# EAGLE design PBase (EAGLE 5.11)
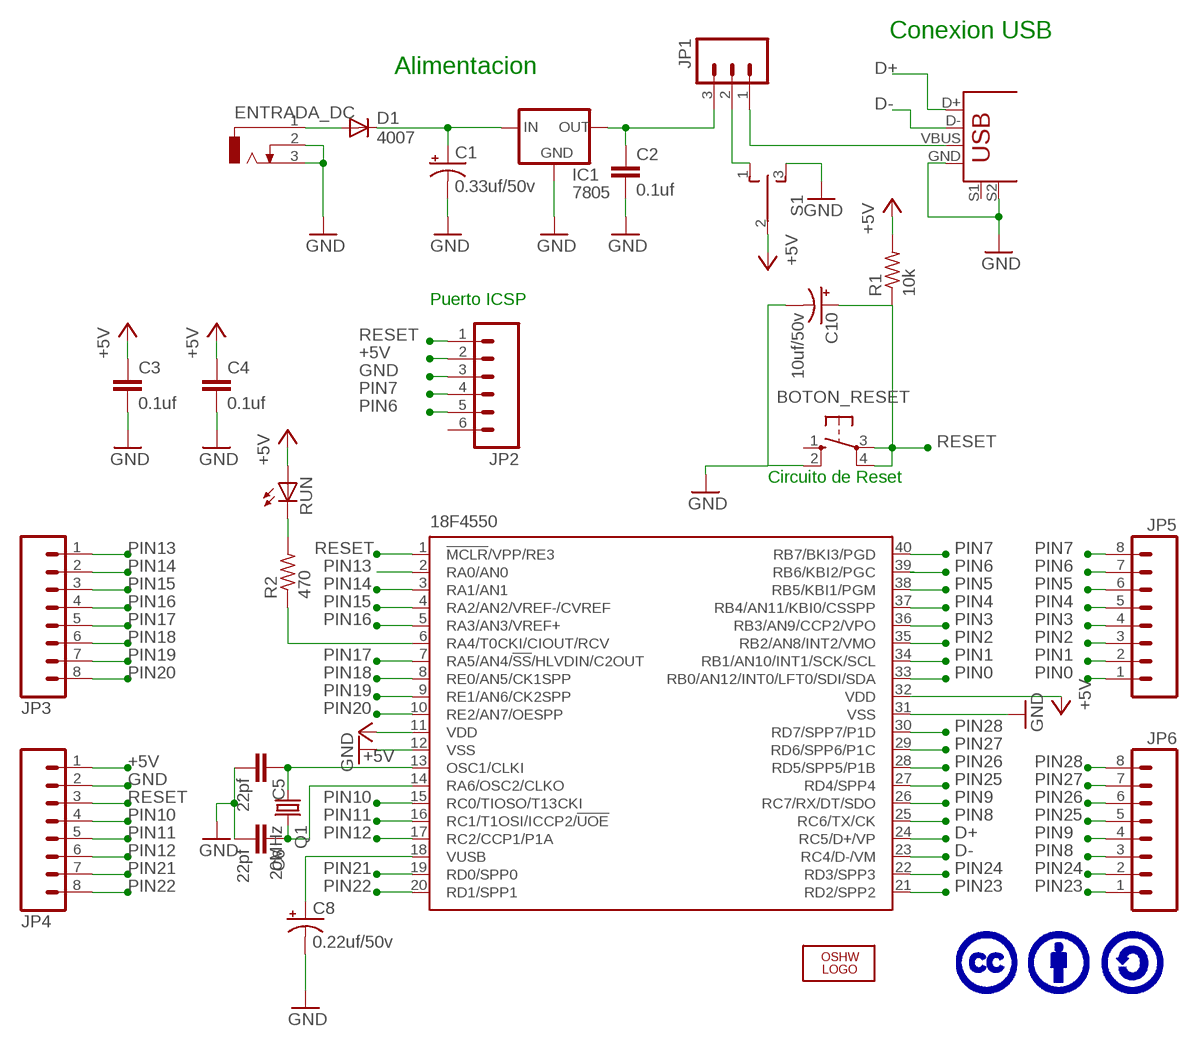
[diagram p0: schematic, sheet 1]

## Parts
18F4550  PIC18F4550_40  [DIL40]
BOTON_RESET  10-XX  [B3F-10XX]
C1  0.33uf/50v  CAP_POLPTH2  [CPOL-RADIAL-10UF-25V]
C2  0.1uf  CAPPTH2  [CAP-PTH-SMALL2]
C3  0.1uf  CAPPTH2  [CAP-PTH-SMALL2]
C4  0.1uf  CAPPTH2  [CAP-PTH-SMALL2]
C5  22pf  CAPPTH2  [CAP-PTH-SMALL2]
C6  22pf  CAPPTH2  [CAP-PTH-SMALL2]
C8  0.22uf/50v  CAP_POLPTH2  [CPOL-RADIAL-10UF-25V]
C10  10uf/50v  CAP_POLPTH2  [CPOL-RADIAL-10UF-25V]
D1  4007  1N4148DO35-7  [DO35-7]
ENTRADA_DC  DCJ0303  [DCJ0303]
IC1  7805  78XXL  [78XXL]
JP1  M03LONGPADS  [1X03_LONGPADS]
JP2  M06LONGPADS  [1X06_LONGPADS]
JP3  M08LONGPADS  [1X08_LONGPADS]
JP4  M08LONGPADS  [1X08_LONGPADS]
JP5  M08LONGPADS  [1X08_LONGPADS]
JP6  M08LONGPADS  [1X08_LONGPADS]
LOGO1  OSHW_LOGO_FILLX0200-NT  [OSHW_FILLX200_NOTEXT]
Q1  20MHz  CRYSTALHC49U-V  [HC49U-V]
R1  10k  R-US_0207/7  [0207/7]
R2  470  R-US_0207/7  [0207/7]
RUN  LED3MM  [LED3MM]
S1  TL39YOSWITCH_2_ESTADOS  [TL3XYO]
U$1  USB+SHIELD  [USB-B-PTH]

## Nets
+5V: 18F4550.11(VDD) 18F4550.32(VDD) C3.1 C4.1 JP2.2 JP4.1 R1.2 RUN.A S1.2(P)
D+: 18F4550.24(RC5/D+/VP) U$1.D+
D-: 18F4550.23(RC4/D-/VM) U$1.D-
GND: 18F4550.12(VSS) 18F4550.31(VSS) BOTON_RESET.2(S1) C1.2(-) C2.2 C3.2 C4.2 C5.2 C6.2 C8.2(-) C10.2(-) ENTRADA_DC.2 ENTRADA_DC.3 IC1.GND JP2.3 JP4.2 S1.3(S) U$1.GND U$1.S2
N$1: 18F4550.13(OSC1/CLKI) C5.1 Q1.1
N$2: C1.1(+) D1.C IC1.IN
N$3: C2.1 IC1.OUT JP1.3
N$4: JP1.1 U$1.VBUS
N$5: 18F4550.14(RA6/OSC2/CLKO) C6.1 Q1.2
N$6: 18F4550.18(VUSB) C8.1(+)
N$7: R2.2 RUN.K(C)
N$8: 18F4550.6(RA4/T0CKI/CIOUT/RCV) R2.1
N$10: JP1.2 S1.1(O)
N$11: D1.A ENTRADA_DC.1
PIN0: 18F4550.33(RB0/AN12/INT0/LFT0/SDI/SDA) JP5.1
PIN1: 18F4550.34(RB1/AN10/INT1/SCK/SCL) JP5.2
PIN2: 18F4550.35(RB2/AN8/INT2/VMO) JP5.3
PIN3: 18F4550.36(RB3/AN9/CCP2/VPO) JP5.4
PIN4: 18F4550.37(RB4/AN11/KBI0/CSSPP) JP5.5
PIN5: 18F4550.38(RB5/KBI1/PGM) JP5.6
PIN6: 18F4550.39(RB6/KBI2/PGC) JP2.5 JP5.7
PIN7: 18F4550.40(RB7/BKI3/PGD) JP2.4 JP5.8
PIN8: 18F4550.25(RC6/TX/CK) JP6.3
PIN9: 18F4550.26(RC7/RX/DT/SDO) JP6.4
PIN10: 18F4550.15(RC0/TIOSO/T13CKI) JP4.4
PIN11: 18F4550.16(RC1/T1OSI/ICCP2/!UOE) JP4.5
PIN12: 18F4550.17(RC2/CCP1/P1A) JP4.6
PIN13: 18F4550.2(RA0/AN0) JP3.1
PIN14: 18F4550.3(RA1/AN1) JP3.2
PIN15: 18F4550.4(RA2/AN2/VREF-/CVREF) JP3.3
PIN16: 18F4550.5(RA3/AN3/VREF+) JP3.4
PIN17: 18F4550.7(RA5/AN4/!SS!/HLVDIN/C2OUT) JP3.5
PIN18: 18F4550.8(RE0/AN5/CK1SPP) JP3.6
PIN19: 18F4550.9(RE1/AN6/CK2SPP) JP3.7
PIN20: 18F4550.10(RE2/AN7/OESPP) JP3.8
PIN21: 18F4550.19(RD0/SPP0) JP4.7
PIN22: 18F4550.20(RD1/SPP1) JP4.8
PIN23: 18F4550.21(RD2/SPP2) JP6.1
PIN24: 18F4550.22(RD3/SPP3) JP6.2
PIN25: 18F4550.27(RD4/SPP4) JP6.5
PIN26: 18F4550.28(RD5/SPP5/P1B) JP6.6
PIN27: 18F4550.29(RD6/SPP6/P1C) JP6.7
PIN28: 18F4550.30(RD7/SPP7/P1D) JP6.8
RESET: 18F4550.1(!MCLR!/VPP/RE3) BOTON_RESET.3(P) BOTON_RESET.4(P1) C10.1(+) JP2.1 JP4.3 R1.1
Unconnected: BOTON_RESET.1(S) JP2.6 U$1.S1

## Notes on the sheet
- Conexion USB
- Alimentacion
- Puerto ICSP
- Circuito de Reset

## Library data of the parts
18F4550 = microchip:PIC18F4*_40: USB Microcontrollers with nanoWatt Technology High-Performance, Enhanced Flash, 28/40/44-Pin, Source: http://ww1.microchip.com/downloads/en/devicedoc/39632c.pdf; MF: MICROCHIP; MPN: PIC18F4550-I/P; OC_FARNELL: 9321357; OC_NEWARK: 74K8623
BOTON_RESET = switch-omron:10-XX: OMRON SWITCH; MPN: B3F-1000; OC_FARNELL: 176432; OC_NEWARK: 36M3542
C1 C8 C10 = SparkFun:CAP_POL: Capacitor Polarized These are standard SMD and PTH capacitors. Normally 10uF, 47uF, and 100uF in electrolytic and tantalum varieties. Always verify the external diameter of the through hole cap, it varies with capacity, voltage, and manufacturer. The EIA devices should be standard.
C2-C6 = SparkFun:CAP: Capacitor Standard 0603 ceramic capacitor, and 0.1" leaded capacitor.
D1 = diode:1N4148: DIODE high speed (Philips)
ENTRADA_DC = jack:DCJ0303: DC POWER JACK Source: DCJ0303.pdf; OC_FARNELL: unknown; OC_NEWARK: unknown
IC1 = v-reg:78XXL: VOLTAGE REGULATOR
JP1 = SparkFun:M03: Header 3 Standard 3-pin 0.1" header. Use with straight break away headers (SKU : PRT-00116), right angle break away headers (PRT-00553), swiss pins (PRT-00743), machine pins (PRT-00117), and female headers (PRT-00115). Molex polarized connector foot print use with SKU : PRT-08232 with associated crimp pins and housings.
JP2 = SparkFun:M06: Header 6 Standard 6-pin 0.1" header. Use with straight break away headers (SKU : PRT-00116), right angle break away headers (PRT-00553), swiss pins (PRT-00743), machine pins (PRT-00117), and female headers (PRT-00115). Molex polarized connector foot print use with SKU : PRT-08094 with associated crimp pins and housings. NOTES ON THE VARIANTS LOCK and LOCK_LONGPADS... This footprint was designed to help hold the alignment of a through-hole component (i.e. 6-pin header) while soldering it into place. You may notice that each hole has been shifted either up or down by 0.005 of an inch from it's more standard position (which is a perfectly straight line). This slight alteration caused the pins (the squares in the middle) to touch the edges of the holes. Because they are alternating, it causes a "brace" to hold the component in place. 0.005 has proven to be the perfect amount of "off-center" position when using our standard breakaway headers. Although looks a little odd when you look at the bare footprint, once you have a header in there, the alteration is very hard to notice. Also, if you push a header all the way into place, it is covered up entirely on the bottom side. This idea of altering the position of holes to aid alignment will be further integrated into the Sparkfun Library for other footprints. It can help hold any component with 3 or more connection pins.
JP3-JP6 = SparkFun:M08: Header 8 Standard 8-pin 0.1" header. Use with straight break away headers (SKU : PRT-00116), right angle break away headers (PRT-00553), swiss pins (PRT-00743), machine pins (PRT-00117), and female headers (PRT-00115).
LOGO1 = OSHW:OSHW_LOGO_FILL
Q1 = crystal:CRYSTAL: CRYSTAL; OC_FARNELL: 1666969; OC_NEWARK: unknown
R1 R2 = resistor:R-US_: RESISTOR, American symbol
RUN = led:LED: LED OSRAM: - CHIPLED LG R971, LG N971, LY N971, LG Q971, LY Q971, LO R971, LY R971 LH N974, LH R974 LS Q976, LO Q976, LY Q976 LO Q996 - Hyper CHIPLED LW Q18S LB Q993, LB Q99A, LB R99A - SideLED LS A670, LO A670, LY A670, LG A670, LP A670 LB A673, LV A673, LT A673, LW A673 LH A674 LY A675 LS A676, LA A676, LO A676, LY A676, LW A676 LS A679, LY A679, LG A679 - Hyper Micro SIDELED® LS Y876, LA Y876, LO Y876, LY Y876 LT Y87S - SmartLED LW L88C, LW L88S LB L89C, LB L89S, LG L890 LS L89K, LO L89K, LY L89K LS L896, LA L896, LO L896, LY L896 - TOPLED LS T670, LO T670, LY T670, LG T670, LP T670 LSG T670, LSP T670, LSY T670, LOP T670, LYG T670 LG T671, LOG T671, LSG T671 LB T673, LV T673, LT T673, LW T673 LH T674 LS T676, LA T676, LO T676, LY T676, LB T676, LH T676, LSB T676, LW T676 LB T67C, LV T67C, LT T67C, LS T67K, LO T67K, LY T67K, LW E67C LS E67B, LA E67B, LO E67B, LY E67B, LB E67C, LV E67C, LT E67C LW T67C LS T679, LY T679, LG T679 LS T770, LO T770, LY T770, LG T770, LP T770 LB T773, LV T773, LT T773, LW T773 LH T774 LS E675, LA E675, LY E675, LS T675 LS T776, LA T776, LO T776, LY T776, LB T776 LHGB T686 LT T68C, LB T68C - Hyper Mini TOPLED® LB M676 - Mini TOPLED Santana® LG M470 LS M47K, LO M47K, LY M47K Source: http://www.osram.convergy.de LUXEON: - LUMILED® LXK2-PW12-R00, LXK2-PW12-S00, LXK2-PW14-U00, LXK2-PW14-V00 LXK2-PM12-R00, LXK2-PM12-S00, LXK2-PM14-U00 LXK2-PE12-Q00, LXK2-PE12-R00, LXK2-PE12-S00, LXK2-PE14-T00, LXK2-PE14-U00 LXK2-PB12-K00, LXK2-PB12-L00, LXK2-PB12-M00, LXK2-PB14-N00, LXK2-PB14-P00, LXK2-PB14-Q00 LXK2-PR12-L00, LXK2-PR12-M00, LXK2-PR14-Q00, LXK2-PR14-R00 LXK2-PD12-Q00, LXK2-PD12-R00, LXK2-PD12-S00 LXK2-PH12-R00, LXK2-PH12-S00 LXK2-PL12-P00, LXK2-PL12-Q00, LXK2-PL12-R00 Source: www.luxeon.com KINGBRIGHT: KA-3528ASYC Source: www.kingbright.com
S1 = aasanchez:TL39YO: TINY SWITCH ON OFF ON Source: http://www2.produktinfo.conrad.com/datenblaetter/700000-724999/705152-da-01-de-Subminiaturschalter_TL_36YO.pdf
U$1 = SparkFun:USB+SHIELD: USB+Shield USB connector with shield pins connectable

## Board
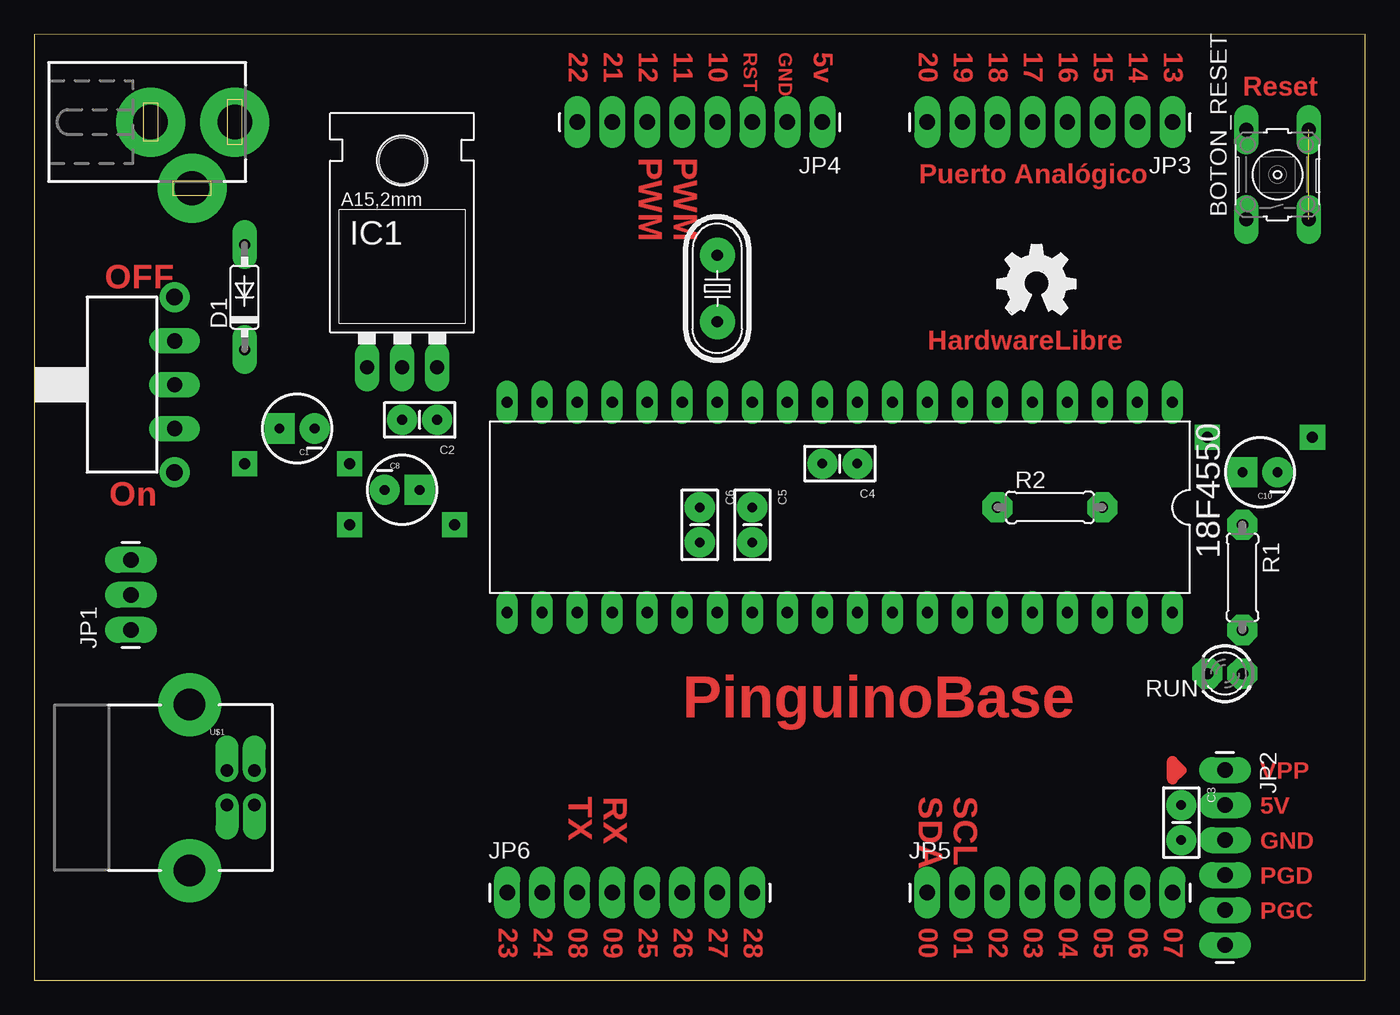
[diagram p1: board, top side]
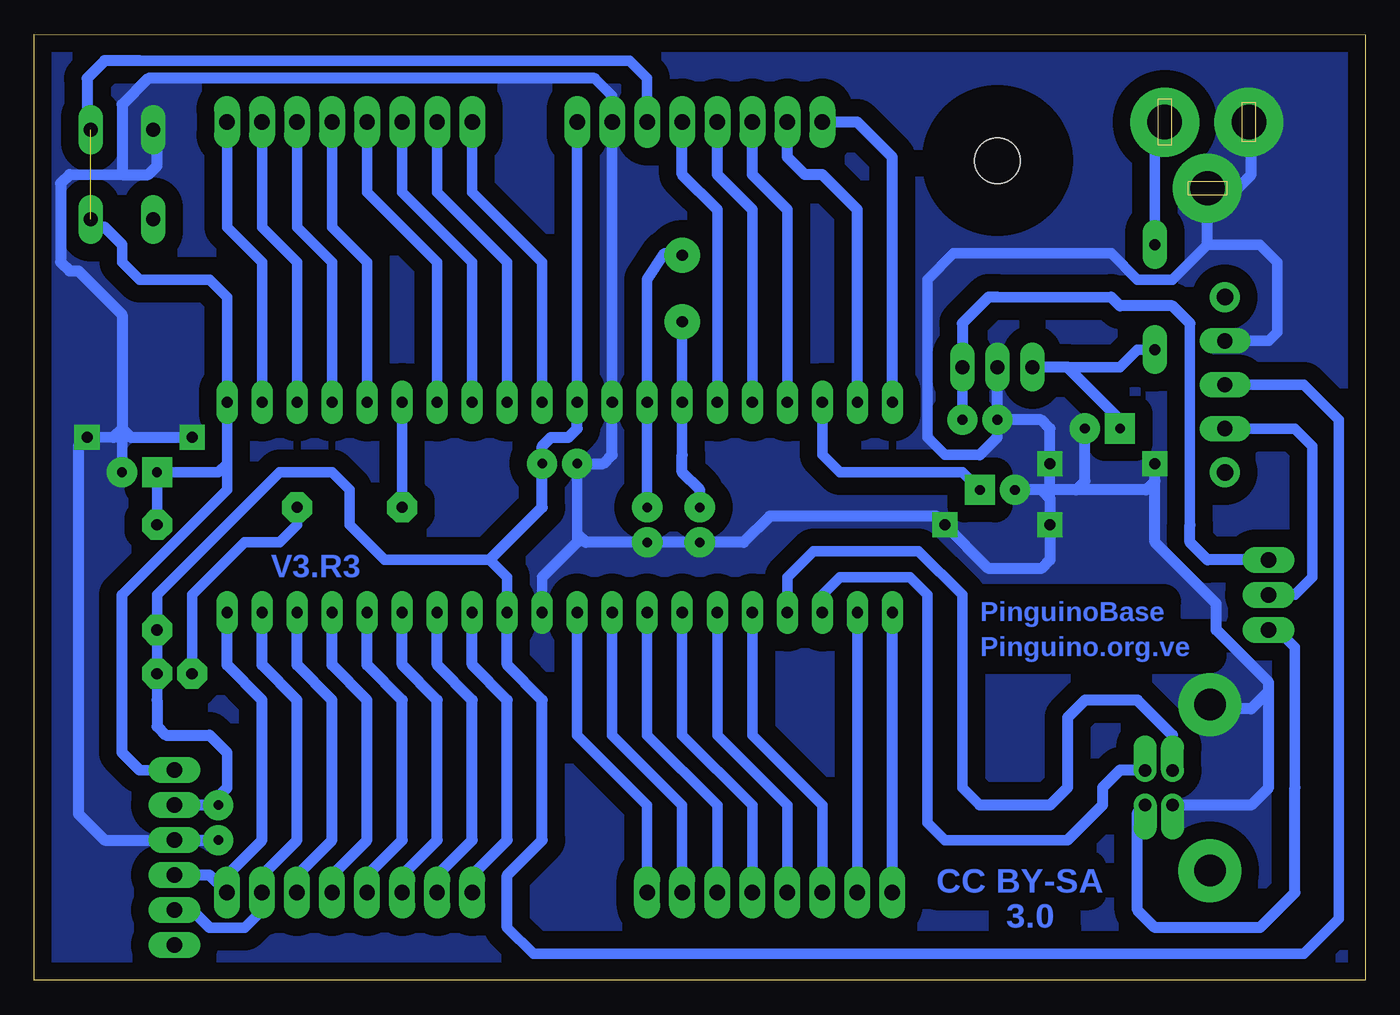
[diagram p2: board, bottom side, seen from below]

Size 96.52 x 68.58 mm. Coordinates in mm from the lower left corner, seen from the top.
Outline: 0,0 96.52,0 96.52,68.58 0,68.57 0,0
Copper layers (1*16): Top 0.035mm / dielectric 1.5mm / Bottom 0.035mm
Design rules: minimum track width 10mil, minimum drill 24mil, track to track 8mil, track to pad 8mil, pad to pad 8mil, via to via 8mil, smd to smd 8mil, copper to edge 40mil, drill to drill 8mil, minimum pad ring 15mil, minimum via ring 20mil, stop-mask expansion 4mil, vias tented up to drill 0mil, thermal gap 60mil

### Footprints (pad centres in the part's own frame; a part is rotated, then mirrored left to right if it is on the bottom)
DIL40 = drill 0.813 long: 1 -24.13,-7.62; 2 -21.59,-7.62; 3 -19.05,-7.62; 4 -16.51,-7.62; 5 -13.97,-7.62; 6 -11.43,-7.62; 7 -8.89,-7.62; 8 -6.35,-7.62; 9 -3.81,-7.62; 10 -1.27,-7.62; 11 1.27,-7.62; 12 3.81,-7.62; 13 6.35,-7.62; 14 8.89,-7.62; 15 11.43,-7.62; 16 13.97,-7.62; 17 16.51,-7.62; 18 19.05,-7.62; 19 21.59,-7.62; 20 24.13,-7.62; 21 24.13,7.62; 22 21.59,7.62; 23 19.05,7.62; 24 16.51,7.62; 25 13.97,7.62; 26 11.43,7.62; 27 8.89,7.62; 28 6.35,7.62; 29 3.81,7.62; 30 1.27,7.62; 31 -1.27,7.62; 32 -3.81,7.62; 33 -6.35,7.62; 34 -8.89,7.62; 35 -11.43,7.62; 36 -13.97,7.62; 37 -16.51,7.62; 38 -19.05,7.62; 39 -21.59,7.62; 40 -24.13,7.62
B3F-10XX = drill 1.016 long: 1 -3.251,2.261; 2 3.251,2.261; 3 -3.251,-2.261; 4 3.251,-2.261
CPOL-RADIAL-10UF-25V = drill 0.7 pad 2.184 square: 1 1.27,0 | drill 0.7 pad 2.184: 2 -1.27,0
CAP-PTH-SMALL2 = drill 0.7 pad 2.184: 1 0,0; 2 2.54,0
DO35-7 = drill 0.813 pad 1.778 long: A 3.81,0; C -3.81,0
DCJ0303 = drill 2.5 pad 5: 1 0,3.1; 2 4.8,0; 3 0,-3
78XXL = drill 1.016 long: GND 0,-3.81; IN -2.54,-3.81; OUT 2.54,-3.81 | hole 3.302: 0,11.176
1X03_LONGPADS = drill 1.118 pad 1.88 long: 1 0,0; 2 2.54,0; 3 5.08,0
1X06_LONGPADS = drill 1.118 pad 1.88 long: 1 0,0; 2 2.54,0; 3 5.08,0; 4 7.62,0; 5 10.16,0; 6 12.7,0
1X08_LONGPADS = drill 1.118 pad 1.88 long: 1 0,0; 2 2.54,0; 3 5.08,0; 4 7.62,0; 5 10.16,0; 6 12.7,0; 7 15.24,0; 8 17.78,0
HC49U-V = drill 0.813 pad 2.54: 1 -2.413,0; 2 2.413,0
0207/7 = drill 0.813 pad 2.184 octagon: 1 -3.81,0; 2 3.81,0
LED3MM = drill 0.813 pad 2.184 octagon: A -1.27,0; K 1.27,0
TL3XYO = drill 1.1 pad 1.422 long: 1 -3.175,-3.81; 2 0,-3.81; 3 3.175,-3.81 | drill 1.2 pad 2.184: M1 -6.35,-3.81; M2 6.35,-3.81
USB-B-PTH = drill 0.914 pad 1.676 offset: D+ 0,1.25; D- 1.981,1.25; GND 0,-1.25; VBUS 1.981,-1.25 | drill 2.286 pad 4.572: S1 -2.718,-6.02; S2 -2.718,6.02

### Placement (x,y rotation side)
18F4550  58.42,34.29 180 top
BOTON_RESET  90.17,58.42 90 top
C1  19.05,40.01 180 top
C2  29.21,40.64 180 top
C3  83.19,12.7 270 top
C4  59.69,37.47 180 top
C5  52.07,34.29 270 top
C6  48.26,34.29 270 top
C8  26.67,35.56 0 top
C10  88.9,36.83 180 top
D1  15.24,49.53 90 top
ENTRADA_DC  11.43,62.23 270 top
IC1  26.67,48.26 0 top
JP1  6.99,25.4 90 top
JP2  86.36,15.24 270 top
JP3  82.55,62.23 180 top
JP4  57.15,62.23 180 top
JP5  64.77,6.35 0 top
JP6  34.29,6.35 0 top
LOGO1  69.85,48.26 0 top
Q1  49.53,50.16 270 top
R1  87.63,29.21 270 top
R2  73.66,34.29 0 top
RUN  86.36,22.23 180 top
S1  6.35,43.18 90 top
U$1  13.97,13.97 0 top

### Tracks (layer width: path | path; a pad name or v marks a point on that pad's centre or on a via)
+5V
  Bottom 0.762: 18F4550.32 62.23,29.21 63.5,30.48 71.12,30.48 73.66,33.02 73.66,35.56 74.93,36.83 78.74,36.83 87.63,27.94 R1.2 RUN.A 87.63,20.32 | 82.55,16.51 82.55,13.97 | 18F4550.11 JP4.1 | S1.2 4.45,43.18 1.91,40.64 1.91,4.45 4.45,1.91 60.33,1.91 62.23,3.81
  Bottom 0.813: 62.23,3.81 62.23,7.62 59.69,10.16 59.69,20.32 62.23,22.86 18F4550.32 | 83.82,12.7 JP2.2 | 82.55,13.97 83.82,12.7 | 82.55,16.51 83.82,17.78 87,17.78 87.63,18.41 87.63,20.32 | 18F4550.11 57.15,40.01 57.78,39.37 59.05,39.37 59.69,38.73 C4.1 59.69,34.29 63.5,30.48 | 83.82,12.7 C3.1
D+
  Bottom 0.762: 18F4550.24 41.91,29.21 40.01,31.11 32.38,31.11 29.21,27.94 29.21,13.97 27.94,12.7
  Bottom 0.813: 27.94,12.7 22.86,12.7 21.59,13.97 21.59,19.05 20.32,20.32 16.51,20.32 13.97,17.78 U$1.D+
D-
  Bottom 0.762: 18F4550.23 39.37,27.94 38.1,29.21 33.02,29.21 31.75,27.94 31.75,11.43 30.48,10.16 21.59,10.16
  Bottom 0.813: 21.59,10.16 19.05,12.7 19.05,13.97 17.78,15.24 15.97,15.24 U$1.D-
GND  (via drill 0.8)
  Bottom 0.762: 59.69,29.21 18F4550.31 | 55.88,65.41 54.61,64.14 JP4.2 18F4550.12 | 57.15,31.75 57.15,32.38 C4.2 | 90.17,58.42 93.98,58.42 | S1.3 6.99,46.35 6.35,46.99 6.35,52.07 7.62,53.34 11.43,53.34 13.97,50.8 16.51,50.8 18.41,52.7 29.84,52.7 31.75,50.8 31.75,39.37 30.48,38.1 27.94,38.1 | C2.2 26.67,39.37 | C10.2 90.17,39.37 90.81,39.37 v92.71,39.37
  Bottom 0.813: 57.15,31.75 59.69,29.21 | IC1.GND C2.2 23.5,40.64 22.86,40.01 v22.86,37.47 22.86,34.92 | 22.86,34.92 v22.86,33.02 22.86,30.48 23.5,29.84 27.3,29.84 v30.48,33.02 31.11,33.66 43.18,33.66 45.09,31.75 C6.2 C5.2 56.52,31.75 57.15,32.38 | 55.88,65.41 88.27,65.41 90.17,63.5 90.17,58.42 88.27,58.42 87.63,59.05 87.63,61.59 BOTON_RESET.2 | 15.24,36.2 v15.24,37.47 | 23.5,35.56 C8.2 | 23.5,35.56 22.86,34.92 | 15.24,36.2 15.88,35.56 20.95,35.56 | 20.95,35.56 23.5,35.56 | C1.2 20.32,36.2 20.95,35.56 | 26.67,39.37 27.94,38.1 | 15.24,36.2 15.24,31.75 10.79,27.3 10.79,25.4 6.99,21.59 6.99,20.95 | 18F4550.12 54.61,38.1 55.24,37.47 C4.2 | 93.98,58.42 94.61,57.78 94.61,52.07 93.98,51.44 93.34,51.44 90.17,48.26 90.17,40.01 | 90.17,40.01 90.81,39.37 | v85.09,39.37 89.53,39.37 90.17,40.01 | 11.43,53.34 ENTRADA_DC.2 11.15,57.15 9.53,57.15 8.26,58.42 8.26,62.05 ENTRADA_DC.3 | 6.99,20.95 8.26,19.68 10.79,19.68 U$1.S2 | 6.99,20.95 6.99,13.97 8.26,12.7 13.95,12.7 U$1.GND | C3.2 JP2.3 91.44,10.16 93.34,12.06 93.34,38.73 v92.71,39.37
  pour Bottom (isolate 1.27, no thermals): 0,0 96.52,0 96.52,68.58 0,68.58
N$1
  Bottom 0.762: 52.07,50.8 18F4550.13 C5.1
  Bottom 0.813: 52.07,50.8 50.8,52.7 49.66,52.7 Q1.1
N$2
  Bottom 0.762: D1.C 16.51,45.72 17.78,44.45 21.59,44.45 | C1.1 17.78,40.64
  Bottom 0.813: 17.78,40.64 21.59,44.45 IC1.IN
N$3
  Bottom 0.762: 12.7,33.02 12.7,47.62 | IC1.OUT C2.1 | 18.41,49.53 26.67,49.53
  Bottom 0.813: 26.67,49.53 27.3,49.53 29.21,47.62 IC1.OUT | 18.41,49.53 17.78,48.9 13.97,48.9 12.7,47.62 | 12.7,33.02 12.7,31.75 11.43,30.48 JP1.3
N$4
  Bottom 0.762: JP1.1 6.35,25.4 5.08,24.13 5.08,13.97
  Bottom 0.813: 5.08,13.97 5.08,6.35 7.62,3.81 15.24,3.81 16.51,5.08 16.51,12.16 U$1.VBUS
N$5
  Bottom 0.762: Q1.2 18F4550.14 49.53,38.1
  Bottom 0.813: C6.1 48.26,35.56 49.53,36.83 49.53,38.1
N$6
  Bottom 0.762: 18F4550.18 39.37,38.1 38.1,36.83 29.21,36.83 C8.1
N$7
  Bottom 0.762: RUN.K 85.09,27.94 81.28,31.75 78.74,31.75 77.47,33.02 R2.2
N$8
  Bottom 0.762: R2.1 18F4550.6
N$9
  Top 0.762: 82.55,15.24 82.55,14.61 83.19,15.24 | 83.19,15.24 82.55,15.88 82.55,15.24 | 82.55,15.24 83.19,15.24
  Top 0.813: 82.55,14.61 82.55,15.88
N$10
  Bottom 0.762: JP1.2 5.08,27.94 3.81,29.21 3.81,38.73 5.08,40.01 S1.1
N$11
  Bottom 0.762: ENTRADA_DC.1 14.61,62.23 15.24,61.59 D1.A
PIN0
  Bottom 0.813: JP5.1 64.77,7.62 62.23,10.16 62.23,20.32 64.77,22.86 18F4550.33
PIN1
  Bottom 0.813: JP5.2 67.31,7.62 64.77,10.16 64.77,20.32 67.31,22.86 18F4550.34
PIN2
  Bottom 0.813: JP5.3 69.85,7.62 67.31,10.16 67.31,20.32 69.85,22.86 18F4550.35
PIN3
  Bottom 0.813: JP5.4 72.39,7.62 69.85,10.16 69.85,20.32 72.39,22.86 18F4550.36
PIN4
  Bottom 0.813: JP5.5 74.93,7.62 72.39,10.16 72.39,20.32 74.93,22.86 18F4550.37
PIN5
  Bottom 0.813: JP5.6 77.47,7.62 74.93,10.16 74.93,20.32 77.47,22.86 18F4550.38
PIN6
  Bottom 0.762: 83.82,3.81 81.28,3.81 80.01,5.08 JP5.7
  Bottom 0.813: JP5.7 80.01,7.62 77.47,10.16 77.47,20.32 80.01,22.86 18F4550.39 | 83.82,3.81 85.09,5.08 JP2.5
PIN7
  Bottom 0.813: 18F4550.40 82.55,22.86 80.01,20.32 80.01,10.16 82.55,7.62 JP5.8 83.82,7.62 JP2.4
PIN8
  Bottom 0.762: 18F4550.25 44.45,17.78 39.37,12.7 JP6.3
PIN9
  Bottom 0.762: 18F4550.26 46.99,17.78 41.91,12.7 JP6.4
PIN10
  Bottom 0.762: 18F4550.15 46.99,55.88
  Bottom 0.813: 46.99,55.88 49.53,58.42 JP4.4
PIN11
  Bottom 0.762: 18F4550.16 44.45,55.88
  Bottom 0.813: 44.45,55.88 46.99,58.42 JP4.5
PIN12
  Bottom 0.762: 18F4550.17 41.91,55.88
  Bottom 0.813: 41.91,55.88 44.45,58.42 JP4.6
PIN13
  Bottom 0.762: 18F4550.2 80.01,52.07 82.55,54.61 JP3.1
PIN14
  Bottom 0.762: 18F4550.3 77.47,52.07 80.01,54.61 JP3.2
PIN15
  Bottom 0.762: 18F4550.4 74.93,52.07 77.47,54.61 JP3.3
PIN16
  Bottom 0.762: 18F4550.5 72.39,52.07 74.93,54.61 JP3.4
PIN17
  Bottom 0.762: 18F4550.7 67.31,52.07 72.39,57.15 JP3.5
PIN18
  Bottom 0.762: 18F4550.8 64.77,52.07 69.85,57.15 JP3.6
PIN19
  Bottom 0.762: 18F4550.9 62.23,52.07 67.31,57.15 JP3.7
PIN20
  Bottom 0.762: 18F4550.10 59.69,52.07 64.77,57.15 JP3.8
PIN21
  Bottom 0.813: 18F4550.19 36.83,55.88 39.37,58.42 40.64,58.42 41.91,59.69 JP4.7
PIN22
  Bottom 0.813: 18F4550.20 34.29,59.69 36.83,62.23 JP4.8
PIN23
  Bottom 0.813: JP6.1 18F4550.21
PIN24
  Bottom 0.762: JP6.2 18F4550.22
PIN25
  Bottom 0.762: 18F4550.27 49.53,17.78 44.45,12.7 JP6.5
PIN26
  Bottom 0.762: 18F4550.28 52.07,17.78 46.99,12.7 JP6.6
PIN27
  Bottom 0.762: 18F4550.29 54.61,17.78 49.53,12.7 JP6.7
PIN28
  Bottom 0.762: 18F4550.30 57.15,17.78 52.07,12.7 JP6.8
RESET  (1 unrouted)
  Bottom 0.762: JP2.1 88.9,15.24 | 82.55,37.47 82.55,35.56 90.17,27.94 | 82.55,37.47 18F4550.1 82.55,49.53 83.82,50.8 88.9,50.8 90.17,52.07 90.17,53.34 | 82.55,37.47 83.19,36.83 C10.1 R1.1 | JP4.3 52.07,65.41 53.34,66.67 88.9,66.67
  Bottom 0.813: 90.17,53.34 91.44,54.61 92.08,54.61 BOTON_RESET.3 | 88.9,66.67 91.44,66.67 92.71,65.41 92.71,62.23 BOTON_RESET.4 | 90.17,27.94 90.17,16.51 88.9,15.24

### Text on the board
Top: 22 | 21 | 12 | 11 | 10 | RST | GND | 5v | 20 | 19 | 18 | 17 | 16 | 15 | 14 | 13 | Reset | PWM | PWM | Puerto Analógico | OFF | HardwareLibre | On | PinguinoBase | VPP | TX | RX | SDA | SCL | 5V | GND | PGD | 23 | 24 | 08 | 09 | 25 | 26 | 27 | 28 | 00 | 01 | 02 | 03 | 04 | 05 | 06 | 07 | PGC
Bottom: V3.R3 | PinguinoBase | Pinguino.org.ve | CC BY-SA | 3.0